# Altium schematic sheet Схема модуля АЦП.SchDoc
size 420 x 297 mm; Address1: Address1; Address2: Address2; Address3: Address3; Address4: Address4; DocumentNumber: АБВГ.123456.001 Э3; SheetNumber: 1; Scale: 1:1; DocumentType: Схема электрическая принципиальная; FirstReferrence: АБВГ.123456.001
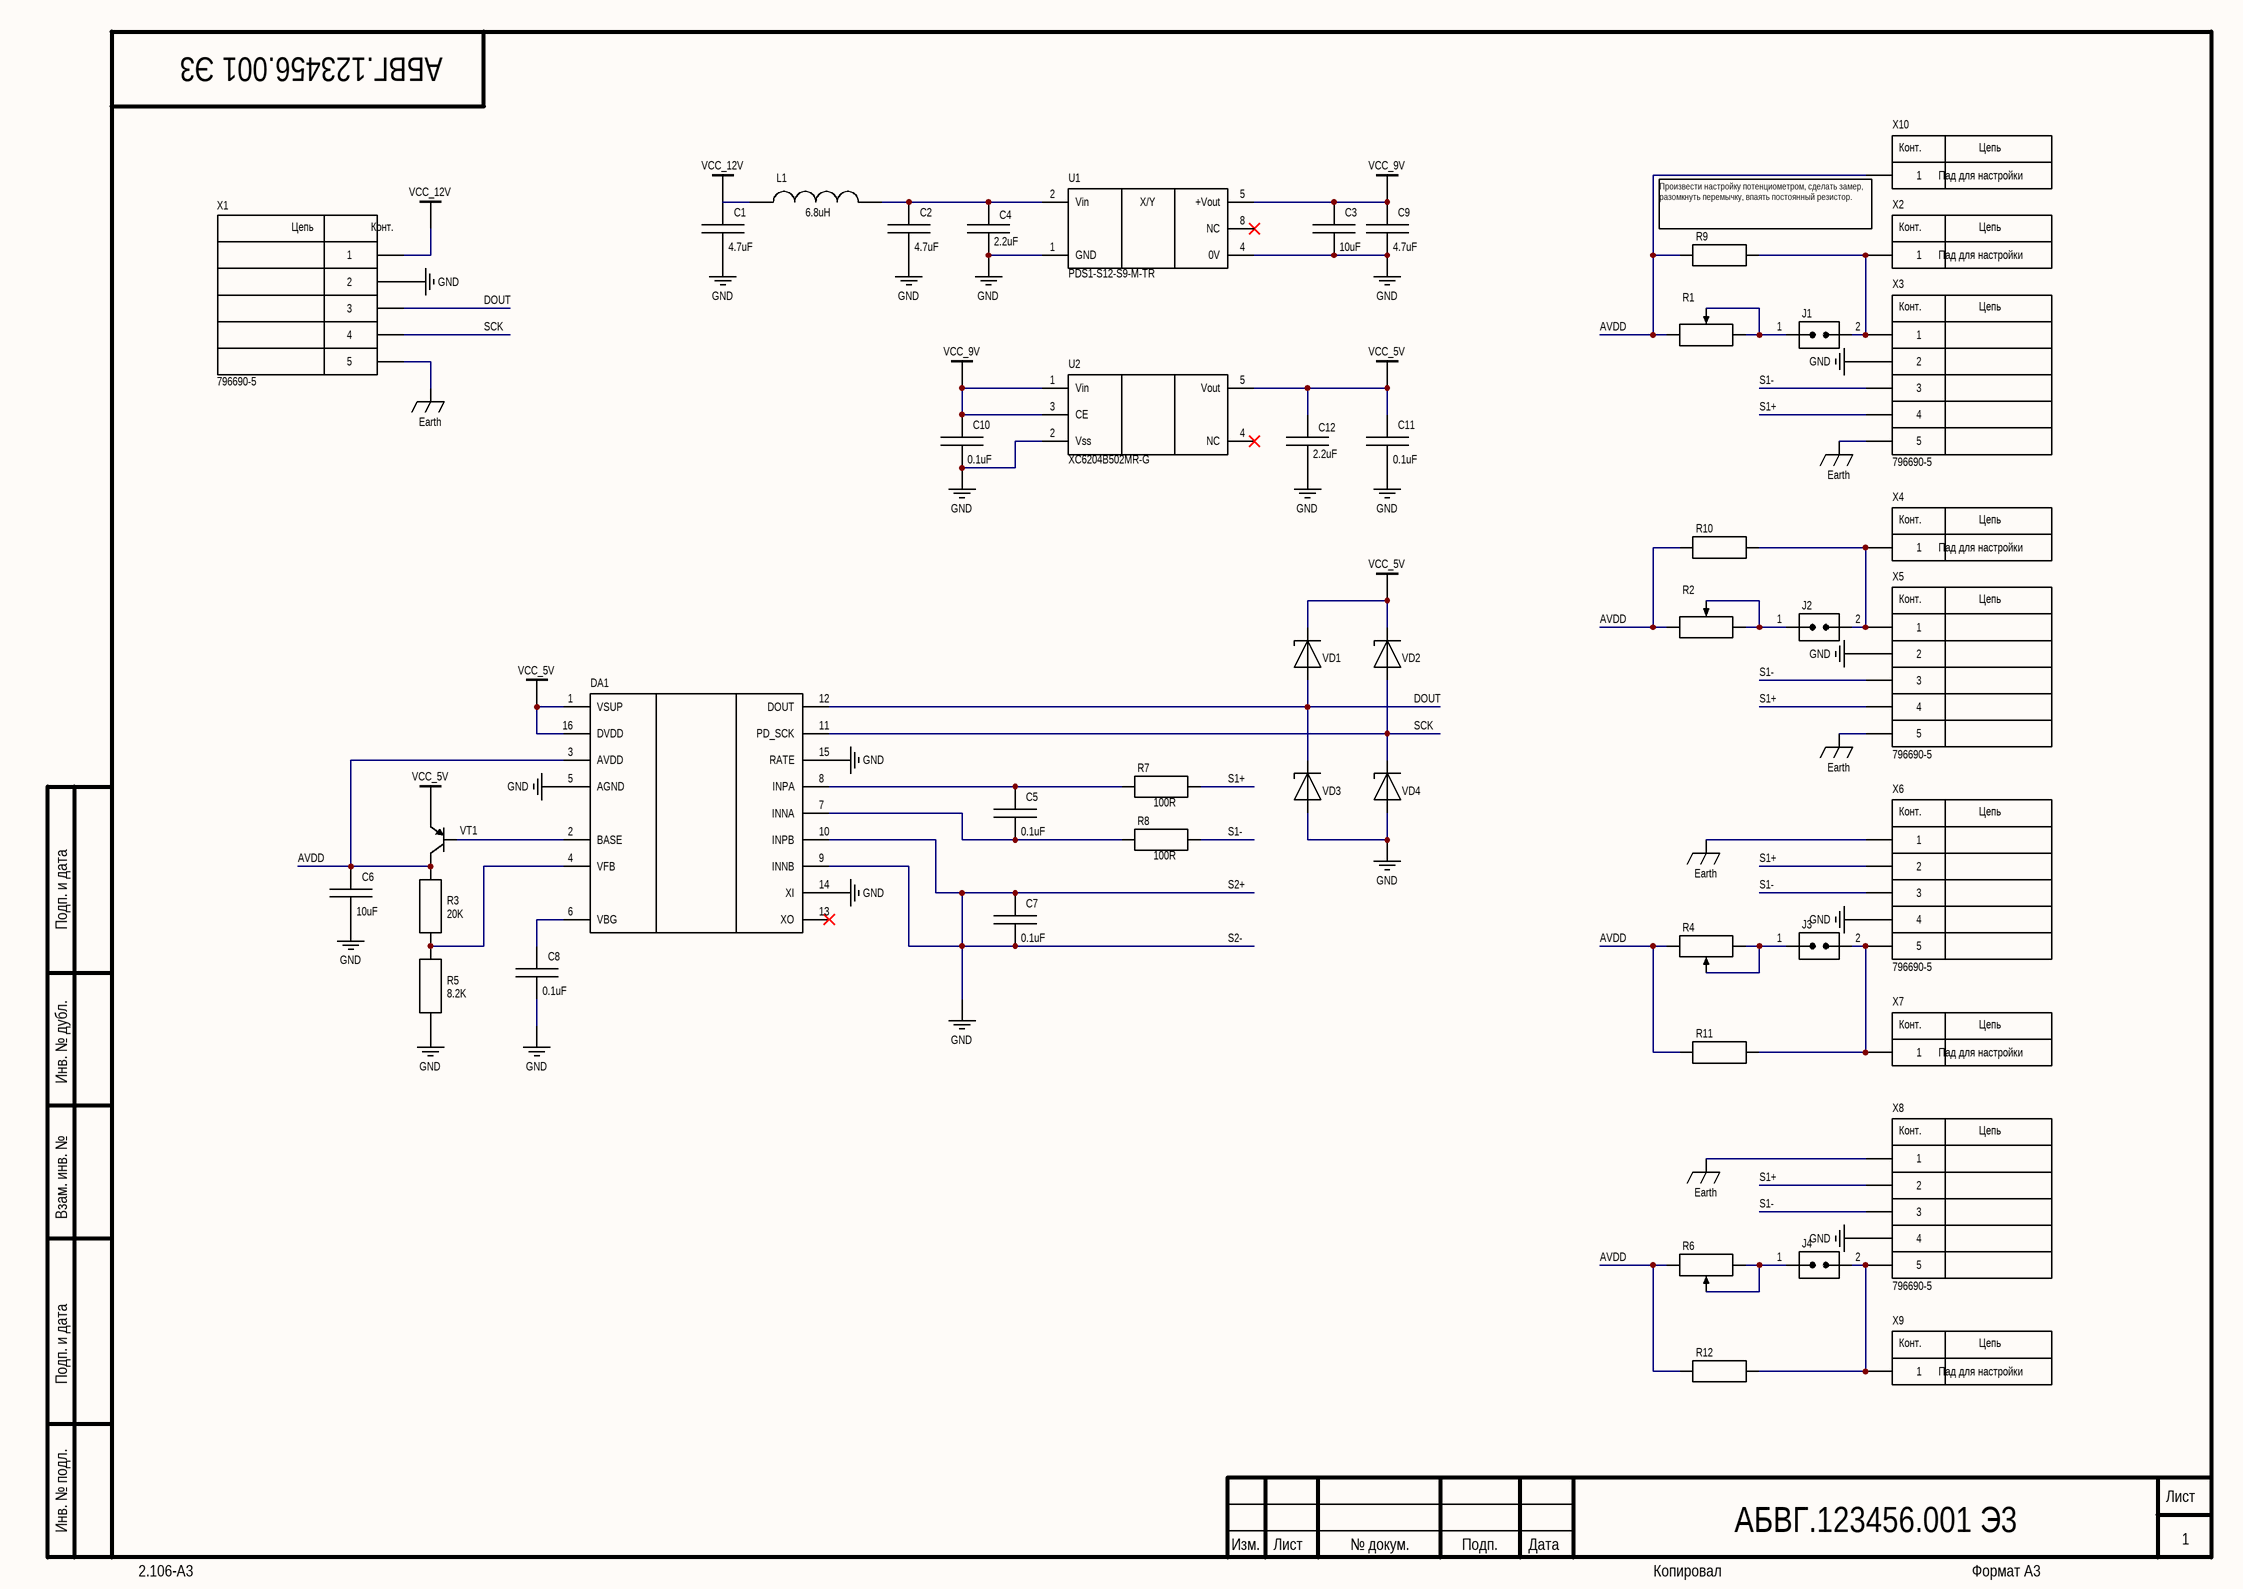
[diagram p0: Схема модуля АЦП.SchDoc]

## Parts
C1  4.7uF  [CH0805C]
C2  4.7uF  [CH0805C]
C3  10uF  [CH1206C]
C4  2.2uF  [CH1206C]
C5  0.1uF  [CH0805C]
C6  10uF  [CH1206C]
C7  0.1uF  [CH0805C]
C8  0.1uF  [CH0805C]
C9  4.7uF  [CH0805C]
C10  0.1uF  [CH0805C]
C11  0.1uF  [CH0805C]
C12  2.2uF  [CH1206C]
DA1  HX711  [16-SOP]  (value not drawn)
J1  Jumper-2  [CON: JUMPER_2]  (value not drawn)
J2  Jumper-2  [CON: JUMPER_2]  (value not drawn)
J3  Jumper-2  [CON: JUMPER_2]  (value not drawn)
J4  Jumper-2  [CON: JUMPER_2]  (value not drawn)
L1  6.8uH  [CH0603L]
R1  50R  [RES: 3296W]  (value not drawn)
R2  50R  [RES: 3296W]  (value not drawn)
R3  20K  [CH0603R]
R4  50R  [RES: 3296W]  (value not drawn)
R5  8.2K  [CH0603R]
R6  50R  [RES: 3296W]  (value not drawn)
R7  100R  [CH0603R]
R8  100R  [CH0603R]
R9  *  [CH0805R]  (value not drawn)
R10  *  [CH0805R]  (value not drawn)
R11  *  [CH0805R]  (value not drawn)
R12  *  [CH0805R]  (value not drawn)
U1  PDS1-S12-S9-M-TR  [B1205XT-1WR3-TR]
U2  XC6204B502MR-G  [SOT23-5]
VD1  SP3031-01ETG  [SOD-882]  (value not drawn)
VD2  SP3031-01ETG  [SOD-882]  (value not drawn)
VD3  SP3031-01ETG  [SOD-882]  (value not drawn)
VD4  SP3031-01ETG  [SOD-882]  (value not drawn)
VT1  MMSS8550-L-TP  [SOT23_132]  (value not drawn)
X1  796690-5  [CON: 796690-5]
X2  *  [CON: PADS 1x1mm]  (value not drawn)  (no BOM)
X3  796690-5  [CON: 796690-5]
X4  *  [CON: PADS 1x1mm]  (value not drawn)  (no BOM)
X5  796690-5  [CON: 796690-5]
X6  796690-5  [CON: 796690-5]
X7  *  [CON: PADS 1x1mm]  (value not drawn)  (no BOM)
X8  796690-5  [CON: 796690-5]
X9  *  [CON: PADS 1x1mm]  (value not drawn)  (no BOM)
X10  *  [CON: PADS 1x1mm]  (value not drawn)  (no BOM)

## Nets
Earth: X1.5 X3.5 X5.5 X6.1 X8.1
S2+: C1.2 C2.2 C3.2 C4.2 C6.2 C7.1 C7.2 C8.2 C9.2 C10.2 C11.2 C12.2 DA1.5(AGND) DA1.9(INNB) DA1.10(INPB) DA1.14(XI) DA1.15(RATE) R5.1 U1.1(GND) U1.4(0V) U2.2(Vss) VD3.1(A) VD4.1(A) X1.2 X3.2 X5.2 X6.4 X8.4  [also labelled GND, S2-]
VCC_5V: C11.1 C12.1 DA1.1(VSUP) DA1.16(DVDD) U2.5(Vout) VD1.2(C) VD2.2(C) VT1.2(E)
VCC_9V: C3.1 C9.1 C10.1 U1.5(+Vout) U2.1(Vin) U2.3(CE)
VCC_12V: C1.1 L1.2 X1.1
AVDD: C6.1 DA1.3(AVDD) R1.1 R2.1 R3.2 R4.1 R6.1 R9.1 R10.1 R11.1 R12.1 VT1.3(C) X10.1(1______Пад_для_настройки)
DOUT: DA1.12(DOUT) VD1.1(A) VD3.2(C) X1.3
S1+: R7.2 X3.4 X5.4 X6.2 X8.2
S1-: R8.2 X3.3 X5.3 X6.3 X8.3
SCK: DA1.11(PD_SCK) VD2.1(A) VD4.2(C) X1.4
NetC2_1: C2.1 C4.1 L1.1 U1.2(Vin)
NetC5_1: C5.1 DA1.8(INPA) R7.1
NetC5_2: C5.2 DA1.7(INNA) R8.1
NetC8_1: C8.1 DA1.6(VBG)
NetDA1_2: DA1.2(BASE) VT1.1(B)
NetDA1_4: DA1.4(VFB) R3.1 R5.2
NetJ1_1: J1.1(IN) R1.2 R1.3
NetJ1_2: J1.2(IN) R9.2 X2.1(1______Пад_для_настройки) X3.1
NetJ2_1: J2.1(IN) R2.2 R2.3
NetJ2_2: J2.2(IN) R10.2 X4.1(1______Пад_для_настройки) X5.1
NetJ3_1: J3.1(IN) R4.2 R4.3
NetJ3_2: J3.2(IN) R11.2 X6.5 X7.1(1______Пад_для_настройки)
NetJ4_1: J4.1(IN) R6.2 R6.3
NetJ4_2: J4.2(IN) R12.2 X8.5 X9.1(1______Пад_для_настройки)

Not connected (* = marked no-connect by the designer): DA1 13(XO)*; U1 8(NC)*; U2 4(NC)*

## Notes on the sheet
- Произвести настройку потенциометром, сделать замер, разомкнуть перемычку, впаять постоянный резистор.
- Подп. и дата
- Инв. № дубл.
- Взам. инв. №
- Инв. № подл.
- Изм.
- Лист
- № докум.
- Подп.
- Дата
- 2.106-A3
- Копировал
- Формат А3
- (in symbol 1-Connector) Конт.; Цепь
- (in symbol 5-Connector) Цепь; Конт.
- (in symbol PDS1-S12-S9-M-TR) X/Y

## Library data of the parts
C1 C2 C9 = Capacitor: 4.7 µF ±10% 50V Ceramic Capacitor X5R 0805 (2012 Metric); Manufacturer: TDK Corporation; Model: C2012X5R1H475K125AB; Tolerance: 5%; Voltage Rating (DC): 16V; Dielectric: X7R; HelpURL: https://www.digikey.com/en/products/detail/tdk-corporation/C2012X5R1H475K125AB/2443458; ComponentKind: 0805 (2012 Metric); Value: 4.7uF; Manufacturer Part Number: C2012X5R1H475K125AB; RoHS: Yes; Category: Ceramic Capacitors; Stock: 24921; Pricing: 1=0,12000, 10=0,08400, 50=0,04760, 100=0,03950, 500=0,02768, 1000=0,02291 (USD); Mount: Surface Mount; Case/Package: 0805; Case Code (Imperial): 0805; Case Code (Metric): 2012; Weight: 0.000194oz; Min Operating Temperature: -55°C; Max Operating Temperature: 125°C; Packaging: Tape and Reel; Voltage Rating: 16V; Termination: SMD/SMT; Resistor Type: Ceramic; Series: CC; Length: 2mm; Width: 0.049inch; Thickness: 0.037inch; Depth: 1.25mm; Radiation Hardening: No; Lead Free: Lead Free; Halogen Free: Halogen Free; RoHS Compliant: Yes; ComponentLink1URL: https://datasheet.ciiva.com/26918/getdatasheetpartid-755584-26918332.pdf?src-supplier=Verical; ComponentLink1Description: https://datasheet.ciiva.com/26918/getdatasheetpartid-755584-26918332.pdf?src-supplier=Verical; Supplier 1: Digi-Key; Supplier Part Number 1: 445-5980-1-ND
C3 C6 = Capacitor: Cap Ceramic 10uF 16V X7R 20% SMD 1206 125°C Embossed T/R; Manufacturer: Samsung Electro-Mechanics; Model: CL31B106MOHNNNE; HelpURL: https://www.digikey.com/en/products/detail/samsung-electro-mechanics/CL31B106MOHNNNE/5961125; ComponentKind: 1206 (3216 Metric); Value: 10uF; Supplier 1: Digi-Key; Supplier Part Number 1: 1276-6641-1-ND; Manufacturer Part Number: CL31B106MOHNNNE; RoHS: Yes; Category: Ceramic Capacitors; Stock: 1126; Pricing: 1=0,22000, 10=0,15000, 50=0,09000, 100=0,07600, 500=0,05202, 1000=0,04602 (USD); Mount: Surface Mount; Case/Package: 1206; Case Code (Metric): 3216; Case Code (Imperial): 1206; Min Operating Temperature: -55°C; Max Operating Temperature: 125°C; Capacitance: 10uF; Tolerance: 20%; Dielectric: X7R; Voltage Rating (DC): 16V; Packaging: Tape and Reel; Voltage Rating: 16V; Length: 0.126inch; Width: 0.063inch; Thickness: 0.071inch; RoHS Compliant: Yes; ComponentLink1URL: http://www.samsungsem.com/kr/support/product-search/mlcc/CL31B106MOHNNNE.jsp?src-supplier=Digi-Key; ComponentLink1Description: http://www.samsungsem.com/kr/support/product-search/mlcc/CL31B106MOHNNNE.jsp?src-supplier=Digi-Key
C4 C12 = Capacitor: Manufacturer: Samsung Electro-Mechanics; Model: CL31B225KOHNNNE; HelpURL: https://www.digikey.com/en/products/detail/samsung-electro-mechanics/CL31B225KOHNNNE/3886922; ComponentKind: 1206 (3216 Metric); Value: 2.2uF; Supplier 1: Digi-Key; Supplier Part Number 1: 1276-1264-1-ND
C5 C7 C8 C10 C11 = Capacitor: Surface Mount Ceramic Multilayer Capacitor 0.1uF 5% X7R 16V 0805 Paper T/R; Manufacturer: YAGEO; Model: CC0805JRX7R7BB104; Capacitance: 100nF; HelpURL: https://www.digikey.com/en/products/detail/yageo/CC0805JRX7R7BB104/5884101; ComponentKind: 0805 (2012 Metric); Value: 0.1uF; Supplier 1: Digi-Key; Supplier Part Number 1: 311-4266-1-ND; Manufacturer Part Number: CC0805JRX7R7BB104; RoHS: Yes; Category: Ceramic Capacitors; Stock: 24921; Pricing: 1=0,12000, 10=0,08400, 50=0,04760, 100=0,03950, 500=0,02768, 1000=0,02291 (USD); Mount: Surface Mount; Case/Package: 0805; Case Code (Imperial): 0805; Case Code (Metric): 2012; Weight: 0.000194oz; Min Operating Temperature: -55°C; Max Operating Temperature: 125°C; Tolerance: 5%; Packaging: Tape and Reel; Voltage Rating (DC): 16V; Voltage Rating: 16V; Dielectric: X7R; Termination: SMD/SMT; Resistor Type: Ceramic; Series: CC; Length: 2mm; Width: 0.049inch; Thickness: 0.037inch; Depth: 1.25mm; Radiation Hardening: No; Lead Free: Lead Free; Halogen Free: Halogen Free; RoHS Compliant: Yes; ComponentLink1URL: https://datasheet.ciiva.com/26918/getdatasheetpartid-755584-26918332.pdf?src-supplier=Verical; ComponentLink1Description: https://datasheet.ciiva.com/26918/getdatasheetpartid-755584-26918332.pdf?src-supplier=Verical
DA1 = HX711: ADC for Weigh Scales; Model: HX711; ComponentKind: SMD; Manufacturer Part Number 1: HX711; HelpURL: https://aliexpress.ru/item/1005002044866368.html?spm=a2g2w.productlist.i0.2.7785407buzs8MK&sku_id=12000018535124718; Parameter 1: *; Supplier 1: AliExpress; Supplier Part Number 1: https://aliexpress.ru/item/1005002044866368.html?spm=a2g2w.productlist.i0.2.7785407buzs8MK&sku_id=12000018535124718
J1-J4 = Jumper-2: Jumper; Manufacturer: China; Model: PLS-2
L1 = Inductor: Manufacturer: TDK Corporation; Model: MLZ1608M6R8WT000; HelpURL: https://www.digikey.com/en/products/detail/tdk-corporation/MLZ1608M6R8WT000/10444788; ComponentKind: 0603 (1608 Metric); Value: 6.8uH; Supplier 1: Digi-Key; Supplier Part Number 1: 445-MLZ1608M6R8WT000CT-ND
R1 R2 R4 R6 = ADJ resistor: 50 Ohms 0.5W, 1/2W PC Pins Through Hole Trimmer Potentiometer Cermet 25.0 Turn Top Adjustment; Manufacturer: Bourns Inc.; Model: 3296W-1-500LF; HelpURL: https://www.digikey.com/en/products/detail/bourns-inc/3296W-1-500LF/1088056?s=N4IgjCBcpgnAHLKoDGUBmBDANgZwKYA0IA9lANogAMIAugL7EBMV8ArMiGpFnkaRRBsqAAgDyACwC2uOsQAOAFyggAqgDsAlorHoAsvky4ArgCd8IRiAC0TTt0Wnj-MpEocGVu25ABmJrAAbADqciCBnJoAJirWYFR2CsqQICDEigCe8hYpUbho9PRAA; ComponentKind: 3296W; Value: 50R; Supplier 1: Digi-Key; Supplier Part Number 1: 3296W-500LF-ND; Supplier 2: Digi-Key; Supplier Part Number 2: 490-2886-ND
R3 = Resistor: Manufacturer: YAGEO; Model: RC0603FR-0720KL; HelpURL: https://www.digikey.com/en/products/detail/yageo/RC0603FR-0720KL/727040; ComponentKind: 0603 (1608 Metric); Value: 20K; Supplier 1: Digi-Key; Supplier Part Number 1: 311-20.0KHRCT-ND
R5 = Resistor: Manufacturer: YAGEO; Model: RC0603FR-078K2L; HelpURL: https://www.digikey.com/en/products/detail/yageo/RC0603FR-078K2L/727390; ComponentKind: https://www.digikey.com/en/products/detail/yageo/RC0603FR-078K2L/727390; Value: 8.2K; Supplier 1: Digi-Key; Supplier Part Number 1: 311-8.20KHRCT-ND
R7 R8 = Resistor: 100 Ohms ±1% 0.1W, 1/10W Chip Resistor 0603 (1608 Metric) Moisture Resistant Thick Film; Manufacturer: YAGEO; Model: RC0603FR-07100RL; HelpURL: https://www.digikey.com/en/products/detail/yageo/RC0603FR-07100RL/726888; ComponentKind: 0603 (1608 Metric); Value: 100R; Supplier 1: Digi-Key; Supplier Part Number 1: 311-100HRCT-ND
R9-R12 = Resistor: Manufacturer: *; Model: *; HelpURL: *; ComponentKind: *; Value: *
U1 = PDS1-S12-S9-M-TR: Isolated Module DC DC Converter 1 Output 9V - - - 111mA 10.8V - 13.2V Input; Manufacturer: CUI Inc.; Model: PDS1-S12-S9-M-TR; HelpURL: https://www.digikey.com/en/products/detail/cui-inc/PDS1-S12-S9-M-TR/4006938; Supplier 1: Digi-Key; Supplier Part Number 1: 102-2970-1-ND
U2 = XC6204B502MR-G: Linear Voltage Regulator IC Positive Fixed 1 Output 150mA SOT-25-5; Manufacturer: Torex Semiconductor Ltd; Model: XC6204B502MR-G; HelpURL: https://www.digikey.com/en/products/detail/torex-semiconductor-ltd/XC6204B502MR-G/2138109; Supplier 1: Digi-Key; Supplier Part Number 1: 893-1065-1-ND; Supplier 2: Digi-Key; Supplier Part Number 2: MCP1802T-5002I/OTCT-ND
VD1-VD4 = Diod Zener: 7.5V (Typ) Clamp 5A (8/20µs) Ipp Tvs Diode Surface Mount SOD-882; Manufacturer: Littelfuse Inc.; ComponentKind: SOD-882; Model: SP3031-01ETG; HelpURL: https://www.digikey.com/en/products/detail/littelfuse-inc/SP3031-01ETG/3598390; Supplier 1: Digi-Key; Supplier Part Number 1: F5769CT-ND
VT1 = PNP: Bipolar; Manufacturer: Micro Commercial Co; Model: MMSS8550-L-TP; ComponentKind: SOT-23; HelpURL: https://www.digikey.com/en/products/detail/micro-commercial-co/MMSS8550-L-TP/2827198; Supplier 1: Digi-Key; Supplier Part Number 1: MMSS8550-L-TPMSCT-ND
X1 X3 X5 X6 X8 = 5-Connector: Manufacturer: TE Connectivity AMP Connectors; Model: 796690-5; HelpURL: https://www.digikey.com/en/products/detail/te-connectivity-amp-connectors/796690-5/1827116; ComponentKind: Through Hole; Supplier 1: Digi-Key; Supplier Part Number 1: A98263-ND
X2 X4 X7 X9 X10 = 1-Connector: Model: *; Manufacturer: *; HelpURL: *; ComponentKind: *